# Altium schematic sheet Power.SchDoc
size A4
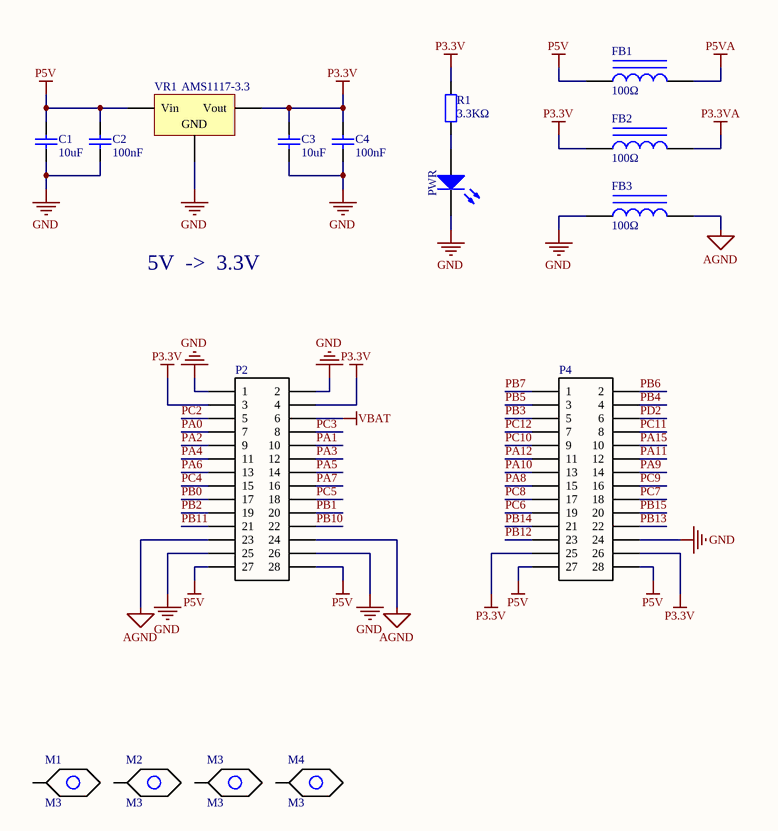
[diagram p0: Power.SchDoc]

## Parts
C1  10uF  [0603_C]
C2  100nF  [0402_C]
C3  10uF  [0603_C]
C4  100nF  [0402_C]
FB1  100Ω  [0805_L]
FB2  100Ω  [0805_L]
FB3  100Ω  [0805_L]
M1  M3  [M3]
M2  M3  [M3]
M3  M3  [M3]
M4  M3  [M3]
P2  Header 14X2  [DIP28-2.54]  (value not drawn)
P4  Header 14X2  [DIP28-2.54]  (value not drawn)
PWR  蓝灯 0603  [0603_LED_S1]  (value not drawn)
R1  3.3KΩ  [0402_R]
VR1  AMS1117-3.3  [SOT-223]

## Nets
AGND: FB3.2 P2.23 P2.24
GND: C1.1 C2.1 C3.1 C4.1 FB3.1 P2.1 P2.2 P2.25 P2.26 P4.24 PWR.K VR1.1(GND)
P3.3V: C3.2 C4.2 FB2.1 P2.3 P2.4 P4.25 P4.26 R1.2 VR1.2(Vout)
P3.3VA: FB2.2
P5V: C1.2 C2.2 FB1.1 P2.27 P2.28 P4.27 P4.28 VR1.3(Vin)
P5VA: FB1.2
VBAT: P2.6
PA0: P2.7
PA1: P2.10
PA2: P2.9
PA3: P2.12
PA4: P2.11
PA5: P2.14
PA6: P2.13
PA7: P2.16
PA8: P4.15
PA9: P4.14
PA10: P4.13
PA11: P4.12
PA12: P4.11
PA15: P4.10
PB0: P2.17
PB1: P2.20
PB2: P2.19
PB3: P4.5
PB4: P4.4
PB5: P4.3
PB6: P4.2
PB7: P4.1
PB10: P2.22
PB11: P2.21
PB12: P4.23
PB13: P4.22
PB14: P4.21
PB15: P4.20
PC2: P2.5
PC3: P2.8
PC4: P2.15
PC5: P2.18
PC6: P4.19
PC7: P4.18
PC8: P4.17
PC9: P4.16
PC10: P4.9
PC11: P4.8
PC12: P4.7
PD2: P4.6
NetPWR_A: PWR.A R1.1

Not connected (* = marked no-connect by the designer): M1 0; M2 0; M3 0; M4 0

## Notes on the sheet
- 5V  ->  3.3V

## Library data of the parts
C1 C3 = 0603 10uF (106) 10% 10V: 贴片电容; ComponentLink1Description: 供应商链接; ComponentLink1URL: http://www.szlcsc.com/product/details_20411.html; Package: 0603; Supplier: LC; SuppliersPartNumber: C19702
C2 C4 = 0402 100nF (104) 10% 16V: 贴片电容; ComponentLink1Description: 供应商链接; ComponentLink1URL: http://www.szlcsc.com/product/details_1877.html; Package: 0402; Supplier: LC; SuppliersPartNumber: C1525
FB1-FB3 = 0805 100Ω 25% 100MHz: 贴片磁珠; ComponentLink1Description: 供应商链接; ComponentLink1URL: http://www.szlcsc.com/product/details_1367.html; Package: 0805; Supplier: LC; SuppliersPartNumber: C1015
P2 P4 = Header 14X2: Header, 14-Pin, Dual row; LatestRevisionDate: 17-Jul-2002; LatestRevisionNote: Re-released for DXP Platform.; Publisher: Altium Limited
PWR = 0603 蓝灯: 发光二极管; ComponentLink1Description: 供应商链接; ComponentLink1URL: http://www.szlcsc.com/product/details_73150.html; Package: 0603; Supplier: LC; SuppliersPartNumber: C72041
R1 = 0402 3.3KΩ (3301) 1%: 贴片电阻; ComponentLink1Description: 供应商链接; ComponentLink1URL: http://www.szlcsc.com/product/details_26633.html; Package: 0402; Supplier: LC; SuppliersPartNumber: C25890
VR1 = SOT-223 AMS1117-3.3: 低压差线性稳压(LDO); ComponentLink1Description: 供应商链接; ComponentLink1URL: http://www.szlcsc.com/product/details_6652.html; Package: SOT-223; Supplier: LC; SuppliersPartNumber: C6186